# EasyEDA schematic STROBO_MP4008_100W_3A_LED_COB_Driver_Rev3.4.json
TITLE: Sheet_1; REV: 1.0; Date: 2019-10-14; Sheet: 1/1; Drawn By: NickF93; Company: Your Company
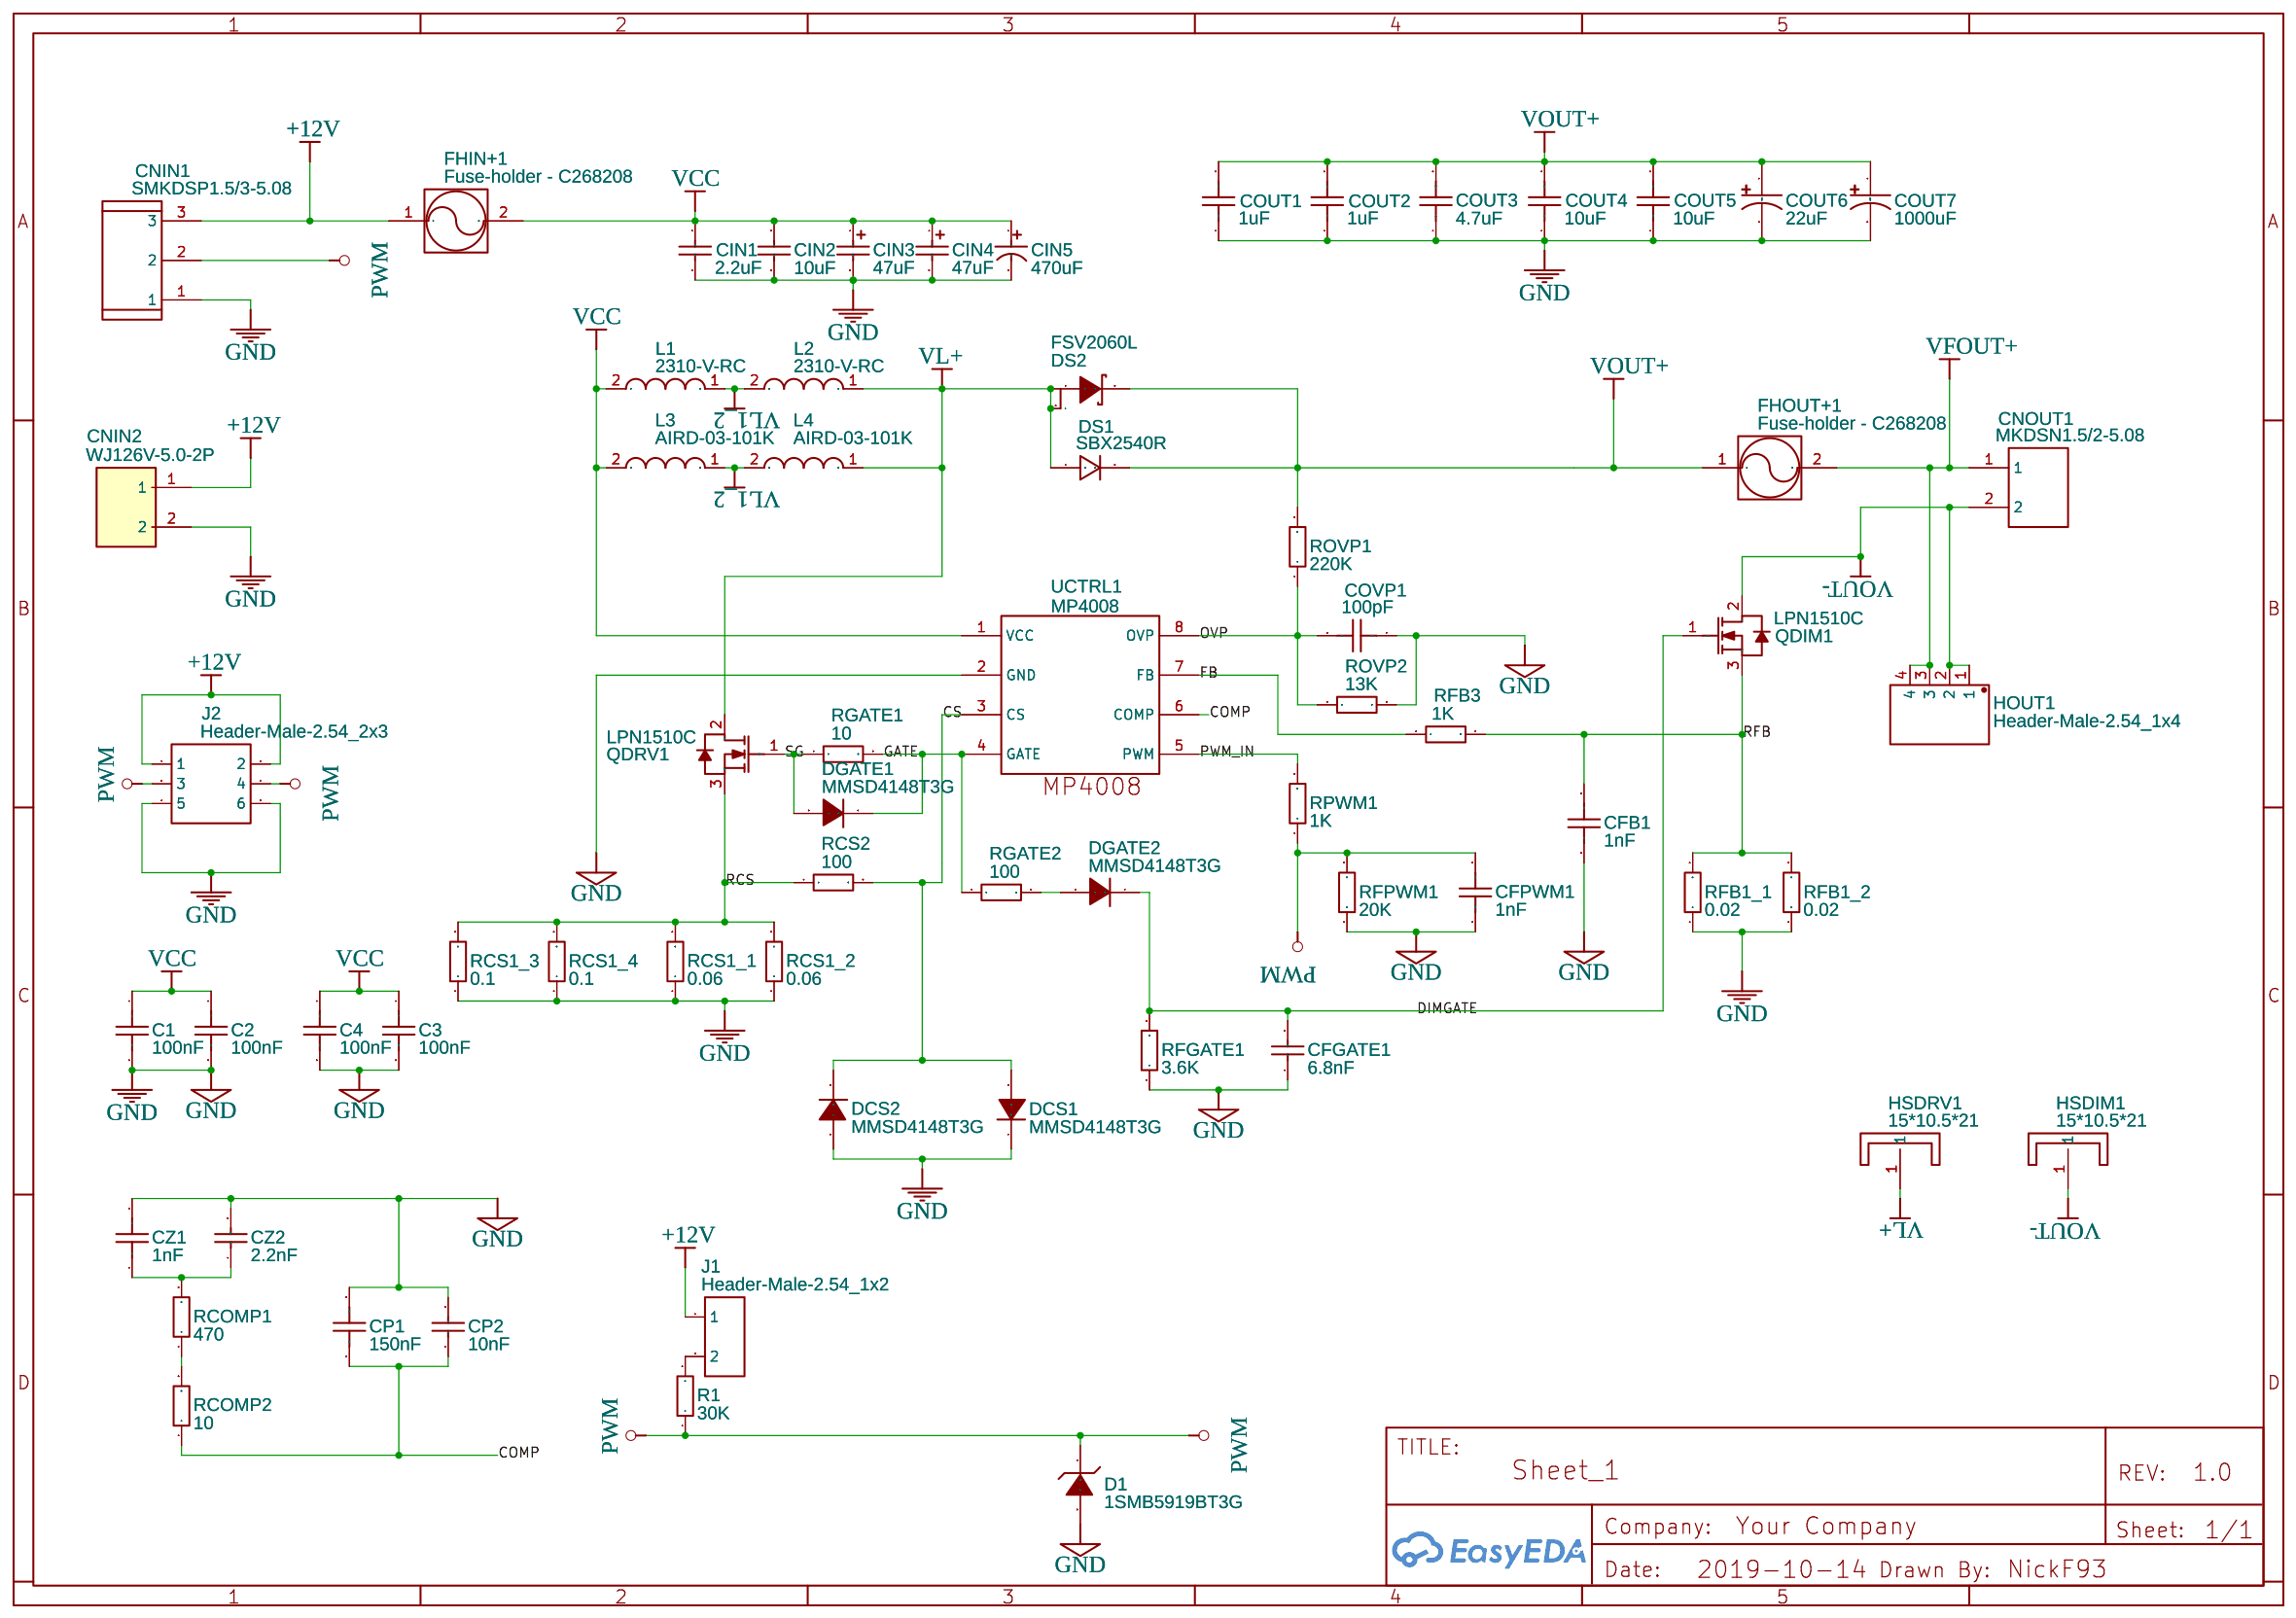
[diagram p0: schematic sheet]

## Parts
C1  100nF  [0603]
C2  100nF  [0603]
C3  100nF  [0603]
C4  100nF  [0603]
CFB1  1nF  [C0603]
CFGATE1  6.8nF  [0603]
CFPWM1  1nF  [C0603]
CIN1  2.2uF  [CAP-0.2]
CIN2  10uF  [1206]
CIN3  47uF  [CAP-SMD_L7.3-W4.3]
CIN4  47uF  [CAP-SMD_L7.3-W4.3]
CIN5  470uF  [CAP-TH_BD10.0-P5.00-D1.0-FD]
CNIN1  SMKDSP1.5/3-5.08  [SMKDSP1.5/3-5.08-W]
CNIN2  WJ126V-5.0-2P  [WJ126V-5.0-2P]
CNOUT1  MKDSN1.5/2-5.08  [MKDSN1.5/2-5.08]
COUT1  1uF  [1206]
COUT2  1uF  [1206]
COUT3  4.7uF  [C1210]
COUT4  10uF  [C2220]
COUT5  10uF  [C2220]
COUT6  22uF  [CAP-SMD_BD10.0-L10.3-W10.3-FD]
COUT7  1000uF  [CAP-TH_BD18.0-P7.50-D1.2-FD]
COVP1  100pF  [0603]
CP1  150nF  [0603]
CP2  10nF  [0603]
CZ1  1nF  [C0603]
CZ2  2.2nF  [0603]
D1  1SMB5919BT3G  [SMB_L4.6-W3.6-LS5.3-RD]
DCS1  MMSD4148T3G  [SOD-123FL_L2.6-W1.6-LS3.4-RD]
DCS2  MMSD4148T3G  [SOD-123FL_L2.6-W1.6-LS3.4-RD]
DGATE1  MMSD4148T3G  [SOD-123FL_L2.6-W1.6-LS3.4-RD]
DGATE2  MMSD4148T3G  [SOD-123FL_L2.6-W1.6-LS3.4-RD]
DS1  SBX2540R  [AXIAL-8.0X7.5]
DS2  FSV2060L  [TO-277B_3P-L6.1-W4.3-LS7.0-BR]
FHIN+1  Fuse-holder - C268208  [FUSE-HOLDER- C268208]
FHOUT+1  Fuse-holder - C268208  [FUSE-HOLDER- C268208]
HOUT1  Header-Male-2.54_1x4  [DIP-1X4P-2.54MM-M]
HSDIM1  15*10.5*21  [15*10.5*21]
HSDRV1  15*10.5*21  [15*10.5*21]
J1  Header-Male-2.54_1x2  [HDR-2X1/2.54]
J2  Header-Male-2.54_2x3  [HDR-TH_6PIN-V-ROW2-COL3-MALE-PITCH2.54]
L1  2310-V-RC  [2310-V-RC]
L2  2310-V-RC  [2310-V-RC]
L3  AIRD-03-101K  [AIRD-03-101K]
L4  AIRD-03-101K  [AIRD-03-101K]
QDIM1  LPN1510C  [TO-220-3_L10.0-W4.5-P2.54-L]
QDRV1  LPN1510C  [TO-220-3_L10.0-W4.5-P2.54-L]
R1  30K  [R0603]
RCOMP1  470  [0603]
RCOMP2  10  [0603]
RCS1_1  0.06  [2512]
RCS1_2  0.06  [2512]
RCS1_3  0.1  [1225]
RCS1_4  0.1  [1225]
RCS2  100  [0603]
RFB1_1  0.02  [2512]
RFB1_2  0.02  [2512]
RFB3  1K  [0603]
RFGATE1  3.6K  [0603]
RFPWM1  20K  [0603]
RGATE1  10  [0603]
RGATE2  100  [0603]
ROVP1  220K  [0603]
ROVP2  13K  [0603]
RPWM1  1K  [0603]
UCTRL1  MP4008  [SOIC-8]

## Library data of the parts
C1-C4 = CC0603JRX7R8BB104: Supplier: LCSC; Supplier Part: C327087; Manufacturer: YAGEO; Contributor: LCSC
CFB1 CFPWM1 CZ1 = TCC0603COG102J500CT: Supplier: LCSC; Supplier Part: C376765; Manufacturer: CCTC; Contributor: LCSC
CFGATE1 = 0603B682J500: Supplier: LCSC; Manufacturer: WTC; Contributor: LCSC; Supplier Part: C123517
CIN1 = CD1H225KC9BER1F000: Supplier: LCSC; Supplier Part: C263192; Manufacturer: Dersonic; Contributor: LCSC
CIN2 = CL31A106KBHNNNE: Supplier: LCSC; Manufacturer: SAMSUNG; LCSC Assembly: Yes; Supplier Part: C13585; SMT Type: Basic
CIN3 CIN4 = TAJD476K025RNJ: Supplier: LCSC; Manufacturer: AVX; Supplier Part: C7228; LCSC Assembly: Yes; SMT Type: Extend
CIN5 = 470UF 50V: Supplier: LCSC; Manufacturer: ValuePro; Manufacturer Part: 普通黑色470UF 50V; Supplier Part: C34642
CNIN1 = -: Supplier: LCSC; Manufacturer: Phoenix Contact; Supplier Part: C93072
CNIN2 = WJ126V-5.0-2P: Supplier: LCSC; Manufacturer: ReliaPro; image: //image.lceda.cn/szlcsc/C8404.jpg; Supplier Part: C8404
CNOUT1 = -: Supplier: LCSC; Manufacturer: Phoenix Contact; Supplier Part: C91153
COUT1 COUT2 = TCC1206X7R105M101HT: Supplier: LCSC; Supplier Part: C282825; Manufacturer: CCTC; Contributor: LCSC
COUT3 = HMK325C7475KMHPE: Supplier: LCSC; Supplier Part: C385986; Manufacturer: Taiyo Yuden; Contributor: LCSC
COUT4 COUT5 = CGA9N3X7S2A106KT0Y0N: Supplier: LCSC; Supplier Part: C342280; Manufacturer: TDK; Contributor: LCSC
COUT6 = 100SXV22M: Supplier: LCSC; Supplier Part: C347571; Manufacturer: PANASONIC; Contributor: LCSC
COUT7 = REA102M2ABK-1840: Supplier: LCSC; Manufacturer: LELON; Contributor: LCSC; Supplier Part: C134530
COVP1 = TCC0603COG101J500CT: Supplier: LCSC; Supplier Part: C344186; Manufacturer: CCTC; Contributor: LCSC
CP1 = TCC0603X7R154K500CT: Supplier: LCSC; Supplier Part: C282674; Manufacturer: CCTC; Contributor: LCSC
CP2 = CC0603JRX7R9BB103: Supplier: LCSC; Manufacturer: YAGEO; Contributor: LCSC; Supplier Part: C115056
CZ2 = CC0603JRNPO9BN222: Supplier: LCSC; Manufacturer: YAGEO; Supplier Part: C107043
D1 = -: Supplier: LCSC; Supplier Part: C70260; Manufacturer: ON Semicon; Contributor: LCSC; LCSC Assembly: Yes; SMT Type: Extend
DCS1 DCS2 DGATE1 DGATE2 = -: Supplier: LCSC; Supplier Part: C232560; Manufacturer: ON Semicon; Contributor: LCSC
DS1 = -: Supplier: LCSC; Supplier Part: C212847; Manufacturer: (DIOTEC); Contributor: LCSC
DS2 = FSV2060L: Supplier: LCSC; Supplier Part: C110669; Manufacturer: ON Semicon; Contributor: LCSC
FHIN+1 FHOUT+1 = -: Supplier Part: C268208; Supplier: LCSC; Contributor: AGRATX
HOUT1 = -: Supplier: LCSC; Manufacturer: Ckmtw; Manufacturer Part: 210S-1*4P L=11.6MMGold-plated black; Contributor: LCSC; Supplier Part: C124378
HSDIM1 HSDRV1 = -: Supplier: LCSC; Supplier Part: C4649; Manufacturer: Made in China; Contributor: LCSC
J1 = -: Supplier: LCSC; Manufacturer: TE Connectivity; Manufacturer Part: 826629-2; image: //image.lceda.cn/szlcsc/C86471.jpg; Supplier Part: C86471
J2 = Header-Male-2.54_2x3: Supplier: LCSC; Manufacturer: BOOMELE; Supplier Part: C65114
L1 L2 = -: Manufacturer: Bourns Inc.; Supplier: Digi-Key; Supplier Part: M8886-ND; link: https://www.digikey.com/product-detail/en/bourns-inc/2310-V-RC/M8886-ND/775425; Contributor: NickF93
L3 L4 = AIRD-03-101K: Contributor: NickF93
QDIM1 QDRV1 = LPN1510C: Supplier: LCSC; Supplier Part: C360167; Manufacturer: Shenzhen Chip Hope Micro-Electronics; Contributor: LCSC
R1 = 0603WAF3002T5E: Supplier: LCSC; Manufacturer: UniOhm; LCSC Assembly: Yes; Supplier Part: C22984; SMT Type: Basic
RCOMP1 = 0603WAF4700T5E: Supplier: LCSC; Manufacturer: UniOhm; LCSC Assembly: Yes; Supplier Part: C23179; SMT Type: Basic
RCOMP2 RGATE1 = 0603WAF100JT5E: Supplier: LCSC; Manufacturer: UniOhm; LCSC Assembly: Yes; Supplier Part: C22859; SMT Type: Basic
RCS1_1 RCS1_2 = MA251230FR060FZ: Supplier: LCSC; Supplier Part: C252688; Manufacturer: Ever Ohms Tech; Contributor: LCSC
RCS1_3 RCS1_4 = CS25FTER100: Supplier: LCSC; Supplier Part: C316196; Manufacturer: Viking Tech; Contributor: LCSC
RCS2 RGATE2 = 0603WAF1000T5E: Supplier: LCSC; Manufacturer: UniOhm; LCSC Assembly: Yes; Supplier Part: C22775; SMT Type: Basic
RFB1_1 RFB1_2 = MS122WF200MT4E: Supplier: LCSC; Manufacturer: UniOhm; Supplier Part: C68608; LCSC Assembly: Yes; SMT Type: Extend
RFB3 RPWM1 = RS-03K1001FT: Supplier: LCSC; Manufacturer: FH; Supplier Part: C115325
RFGATE1 = 0603WAF3601T5E: Supplier: LCSC; Manufacturer: UniOhm; LCSC Assembly: Yes; Supplier Part: C22980; SMT Type: Basic
RFPWM1 = 0603WAF2002T5E: Supplier: LCSC; Manufacturer: UniOhm; LCSC Assembly: Yes; Supplier Part: C4184; SMT Type: Basic
ROVP1 = 0603WAF2203T5E: Supplier: LCSC; Manufacturer: UniOhm; LCSC Assembly: Yes; Supplier Part: C22961; SMT Type: Basic
ROVP2 = 0603WAF1302T5E: Supplier: LCSC; Manufacturer: UniOhm; LCSC Assembly: Yes; Supplier Part: C22797; SMT Type: Basic
UCTRL1 = -: Manufacturer: MPS; Supplier: Digi-Key; Contributor: NickF93

## Nets
+12V: CNIN1.3 CNIN2.1 FHIN+1.1 J1.1 J2.1 J2.2
GND: C1.2 C2.2 C3.2 C4.2 CFB1.1 CFGATE1.1 CFPWM1.1 CIN1.1 CIN2.1 CIN3.2 CIN4.2 CIN5.2 CNIN1.1 CNIN2.2 COUT1.1 COUT2.1 COUT3.1 COUT4.1 COUT5.1 COUT6.2 COUT7.2 COVP1.1 CP1.2 CP2.2 CZ1.2 CZ2.2 D1.2(A) DCS1.1(C) DCS2.2(A) J2.5 J2.6 RCS1_1.1 RCS1_2.1 RCS1_3.1 RCS1_4.1 RFB1_1.1 RFB1_2.1 RFGATE1.1 RFPWM1.1 ROVP2.2 UCTRL1.2(GND)
VCC: C1.1 C2.1 C3.1 C4.1 CIN1.2 CIN2.2 CIN3.1 CIN4.1 CIN5.1 FHIN+1.2 L1.2 L3.2 UCTRL1.1(VCC)
COMP: CP1.1 CP2.1 RCOMP2.1 UCTRL1.6(COMP)
CS: DCS1.2(A) DCS2.1(C) RCS2.2 UCTRL1.3(CS)
DIMGATE: CFGATE1.2 DGATE2.1(C) QDIM1.1(G) RFGATE1.2
FB: RFB3.1 UCTRL1.7(FB)
GATE: DGATE1.1(C) RGATE1.2 RGATE2.1 UCTRL1.4(GATE)
OVP: COVP1.2 ROVP1.1 ROVP2.1 UCTRL1.8(OVP)
PWM: CFPWM1.2 CNIN1.2 D1.1(K) J2.3 J2.4 R1.1 RFPWM1.2 RPWM1.1
PWM_IN: RPWM1.2 UCTRL1.5(PWM)
RCS: QDRV1.3(S) RCS1_1.2 RCS1_2.2 RCS1_3.2 RCS1_4.2 RCS2.1
RFB: CFB1.2 QDIM1.3(S) RFB1_1.2 RFB1_2.2 RFB3.2
SG: DGATE1.2(A) QDRV1.1(G) RGATE1.1
VFOUT+: CNOUT1.1 FHOUT+1.2 HOUT1.3 HOUT1.4
VL1_2: L1.1 L2.2 L3.1 L4.2
VL+: DS1.1 DS2.1(A) DS2.2(A) HSDRV1.1 L2.1 L4.1 QDRV1.2(D)
VOUT+: COUT1.2 COUT2.2 COUT3.2 COUT4.2 COUT5.2 COUT6.1 COUT7.1 DS1.2 DS2.3(K) FHOUT+1.1 ROVP1.2
VOUT-: CNOUT1.2 HOUT1.1 HOUT1.2 HSDIM1.1 QDIM1.2(D)
Net-(CZ1-1): CZ1.1 CZ2.1 RCOMP1.2
Net-(DGATE2-2): DGATE2.2(A) RGATE2.2
Net-(J1-2): J1.2 R1.2
Net-(RCOMP1-1): RCOMP1.1 RCOMP2.2
